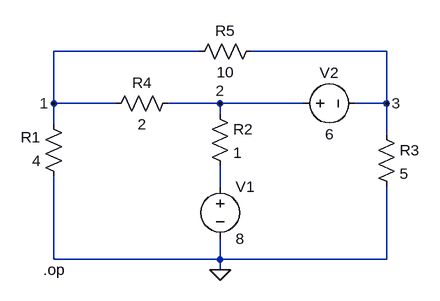
[diagram p0: schematic KVL_Verification_diy.asc]
KVL_Verification_diy.asc, the LTspice schematic file:
Version 4
SHEET 1 880 680
WIRE 160 48 -64 48
WIRE 448 48 240 48
WIRE -64 128 -64 48
WIRE 32 128 -64 128
WIRE 192 128 112 128
WIRE 320 128 192 128
WIRE 448 128 448 48
WIRE 448 128 400 128
WIRE 192 144 192 128
WIRE -64 160 -64 128
WIRE 448 176 448 128
WIRE 192 256 192 224
WIRE -64 368 -64 240
WIRE 192 368 192 336
WIRE 192 368 -64 368
WIRE 448 368 448 256
WIRE 448 368 192 368
WIRE 192 384 192 368
FLAG 192 384 0
FLAG -64 128 1
FLAG 192 128 2
FLAG 448 128 3
SYMBOL res -48 256 R180
WINDOW 0 36 76 Left 2
WINDOW 3 36 40 Left 2
SYMATTR InstName R1
SYMATTR Value 4
SYMBOL res 176 128 R0
SYMATTR InstName R2
SYMATTR Value 1
SYMBOL res 432 160 R0
SYMATTR InstName R3
SYMATTR Value 5
SYMBOL res 128 112 R90
WINDOW 0 0 56 VBottom 2
WINDOW 3 32 56 VTop 2
SYMATTR InstName R4
SYMATTR Value 2
SYMBOL res 144 64 R270
WINDOW 0 32 56 VTop 2
WINDOW 3 0 56 VBottom 2
SYMATTR InstName R5
SYMATTR Value 10
SYMBOL voltage 192 240 R0
SYMATTR InstName V1
SYMATTR Value 8
SYMBOL voltage 304 128 R270
WINDOW 0 32 56 VTop 2
WINDOW 3 -32 56 VBottom 2
SYMATTR InstName V2
SYMATTR Value 6
TEXT -80 384 Left 2 !.op

The netlist it stands for:
* KVL_Verification_diy.asc
R1 0 1 4
R2 2 N001 1
R3 3 0 5
R4 2 1 2
R5 1 3 10
V1 N001 0 8
V2 2 3 6
.op
.backanno
.end